# EAGLE design JP Eagle Daughter Board (EAGLE 9.6.2)
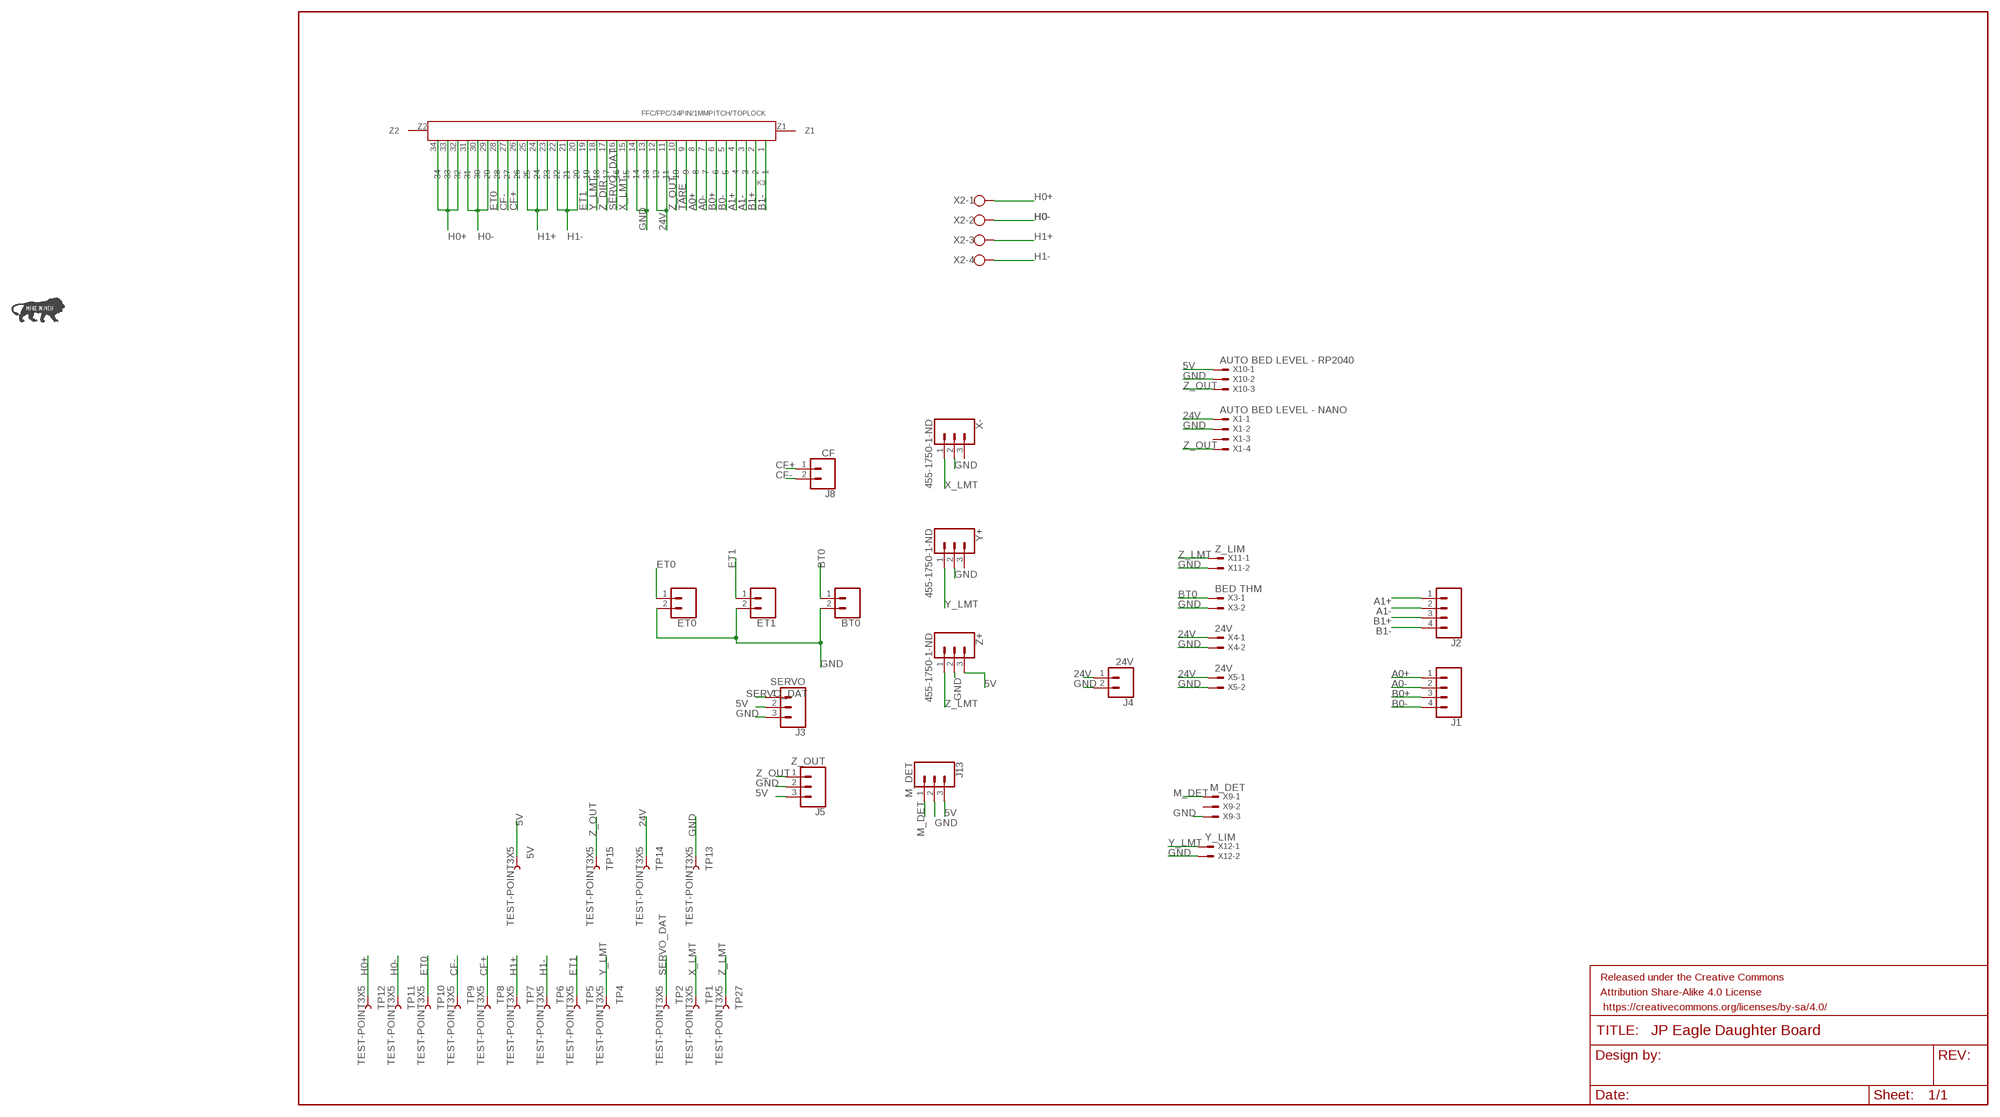
[diagram p0: schematic, sheet 1]

## Parts
5V  TEST-POINT3X5  [PAD.03X.05]
BT0  CONN_02  [1X02]
ET0  CONN_02  [1X02]
ET1  CONN_02  [1X02]
FRAME1  FRAME-LEDGER  [CREATIVE_COMMONS]
J1  CONN_04  [1X04]
J2  CONN_04  [1X04]
J3  SERVO  CONN_03  [1X03]
J4  24V  CONN_02  [1X02]
J5  Z_OUT  CONN_03  [1X03]
J8  CF  CONN_02  [1X02]
J13  M_DET  CONN_03  [1X03]
K3  FFC/FPC/34PIN/1MMPITCH/TOPLOCK  [34PIN/1MMPITCH/FFC/FPC]
TP1  TEST-POINT3X5  [PAD.03X.05]
TP2  TEST-POINT3X5  [PAD.03X.05]
TP4  TEST-POINT3X5  [PAD.03X.05]
TP5  TEST-POINT3X5  [PAD.03X.05]
TP6  TEST-POINT3X5  [PAD.03X.05]
TP7  TEST-POINT3X5  [PAD.03X.05]
TP8  TEST-POINT3X5  [PAD.03X.05]
TP9  TEST-POINT3X5  [PAD.03X.05]
TP10  TEST-POINT3X5  [PAD.03X.05]
TP11  TEST-POINT3X5  [PAD.03X.05]
TP12  TEST-POINT3X5  [PAD.03X.05]
TP13  TEST-POINT3X5  [PAD.03X.05]
TP14  TEST-POINT3X5  [PAD.03X.05]
TP15  TEST-POINT3X5  [PAD.03X.05]
TP27  TEST-POINT3X5  [PAD.03X.05]
U$2  MAKEININDIA  [MAKEININDIA]
X1  AUTO BED LEVEL - NANO  JST-XH-04-PIN-LONG-PAD  [JST-XH-04-PACKAGE-LONG-PAD]
X2  W237-4  [W237-4]
X3  BED THM  JST-XH-02-PIN-LONG-PAD  [JST-XH-02-PACKAGE-LONG-PAD]
X4  24V  JST-XH-02-PIN-LONG-PAD  [JST-XH-02-PACKAGE-LONG-PAD]
X5  24V  JST-XH-02-PIN-LONG-PAD  [JST-XH-02-PACKAGE-LONG-PAD]
X9  M_DET  JST-XH-03-PIN-LONG-PAD  [JST-XH-03-PACKAGE-LONG-PAD]
X10  AUTO BED LEVEL - RP2040  JST-XH-03-PIN-LONG-PAD  [JST-XH-03-PACKAGE-LONG-PAD]
X11  Z_LIM  JST-XH-02-PIN-LONG-PAD  [JST-XH-02-PACKAGE-LONG-PAD]
X12  Y_LIM  JST-XH-02-PIN-LONG-PAD  [JST-XH-02-PACKAGE-LONG-PAD]
X-  455-1750-1-ND  CONN_03  [1X03]
Y+  455-1750-1-ND  CONN_03  [1X03]
Z+  455-1750-1-ND  CONN_03  [1X03]

## Nets
5V: 5V.P$1 J3.2 J5.3 J13.3 X10.1 Z+.3
24V: J4.1 K3.11 K3.12 TP14.P$1 X1.1 X4.1 X5.1
A0+: J1.1 K3.8
A0-: J1.2 K3.7
A1+: J2.1 K3.4
A1-: J2.2 K3.3
B0+: J1.3 K3.6
B0-: J1.4 K3.5
B1+: J2.3 K3.2
B1-: J2.4 K3.1
BT0: BT0.1 X3.1
CF+: J8.1 K3.26 TP8.P$1
CF-: J8.2 K3.27 TP9.P$1
ET0: ET0.1 K3.28 TP10.P$1
ET1: ET1.1 K3.19 TP5.P$1
GND: BT0.2 ET0.2 ET1.2 J3.3 J4.2 J5.2 J13.2 K3.13 K3.14 TP13.P$1 X1.2 X3.2 X4.2 X5.2 X9.3 X10.2 X11.2 X12.2 X-.2 Y+.2 Z+.2
H0+: K3.32 K3.33 K3.34 TP12.P$1 X2.1
H0-: K3.29 K3.30 K3.31 TP11.P$1 X2.2
H1+: K3.23 K3.24 K3.25 TP7.P$1 X2.3
H1-: K3.20 K3.21 K3.22 TP6.P$1 X2.4
M_DET: J13.1 X9.1
SERVO_DAT: J3.1 K3.16 TP2.P$1
TARE: K3.9
X_LMT: K3.15 TP1.P$1 X-.1
Y_LMT: K3.18 TP4.P$1 X12.1 Y+.1
Z_DIR: K3.17
Z_LMT: TP27.P$1 X11.1 Z+.1
Z_OUT: J5.1 K3.10 TP15.P$1 X1.4 X10.3
Unconnected: K3.Z1 K3.Z2 X1.3 X9.2 X-.3 Y+.3

## Library data of the parts
5V TP1 TP2 TP4-TP15 TP27 = SparkFun-Connectors:TEST-POINT: SparkFun Test Points Bare copper test points for troubleshooting or In-Circuit-Testing. These are used by our Production team for verifying production board runs using pogo-pins on test beds. SparkFun Products: SparkFun LSM9DS1 Breakout <https://www.sparkfun.com/products/13284> SparkFun PSOC <https://www.sparkfun.com/products/13714> SparkFun Load Cell Amplifier <https://www.sparkfun.com/products/13879>
BT0 ET0 ET1 J4 J8 = SparkFun-Connectors:CONN_02: Multi connection point. Often used as Generic Header-pin footprint for 0.1 inch spaced/style header connections On any of the 0.1 inch spaced packages, you can populate with these: Break Away Headers - Straight <https://www.sparkfun.com/products/116> (PRT-00116) Break Away Male Headers - Right Angle <https://www.sparkfun.com/products/553> (PRT-00553) Female Headers <https://www.sparkfun.com/products/115> (PRT-00115) Break Away Headers - Machine Pin <https://www.sparkfun.com/products/117> (PRT-00117) Break Away Female Headers - Swiss Machine Pin <https://www.sparkfun.com/products/743> (PRT-00743) For SCREWTERMINALS and SPRING TERMINALS visit here: Screw Terimnals on SparkFun.com <https://www.sparkfun.com/search/results?term=Screw+Terminals> (5mm/3.5mm/2.54mm spacing) This device is also useful as a general connection point to wire up your design to another part of your project. Our various solder wires solder well into these plated through hole pads. Hook-Up Wire - Assortment (Stranded, 22 AWG) <https://www.sparkfun.com/products/11375> (PRT-11375) Hook-Up Wire - Assortment (Solid Core, 22 AWG) <https://www.sparkfun.com/products/11367> (PRT-11367) View the entire wire category on our website here <https://www.sparkfun.com/categories/141> Special notes: Molex polarized connector foot print use with: PRT-08233 with associated crimp pins and housings. 2.54_SCREWTERM for use with PRT-10571. 3.5mm Screw Terminal footprints for PRT-08084 5mm Screw Terminal footprints for use with PRT-08432
FRAME1 = SparkFun-Aesthetics:FRAME-LEDGER: Schematic Frame - Ledger Standard 11x14 US Ledger frame
J1 J2 = SparkFun-Connectors:CONN_04: Multi connection point. Often used as Generic Header-pin footprint for 0.1 inch spaced/style header connections On any of the 0.1 inch spaced packages, you can populate with these: Break Away Headers - Straight <https://www.sparkfun.com/products/116> (PRT-00116) Break Away Male Headers - Right Angle <https://www.sparkfun.com/products/553> (PRT-00553) Female Headers <https://www.sparkfun.com/products/115> (PRT-00115) Break Away Headers - Machine Pin <https://www.sparkfun.com/products/117> (PRT-00117) Break Away Female Headers - Swiss Machine Pin <https://www.sparkfun.com/products/743> (PRT-00743) For SCREWTERMINALS and SPRING TERMINALS visit here: Screw Terimnals on SparkFun.com <https://www.sparkfun.com/search/results?term=Screw+Terminals> (5mm/3.5mm/2.54mm spacing) This device is also useful as a general connection point to wire up your design to another part of your project. Our various solder wires solder well into these plated through hole pads. Hook-Up Wire - Assortment (Stranded, 22 AWG) <https://www.sparkfun.com/products/11375> (PRT-11375) Hook-Up Wire - Assortment (Solid Core, 22 AWG) <https://www.sparkfun.com/products/11367> (PRT-11367) View the entire wire category on our website here <https://www.sparkfun.com/categories/141> Special notes: Molex polarized connector foot print use with SKU : PRT-08231 with associated crimp pins and housings. 1MM SMD Version SKU: PRT-10208; PROD_ID: CONN-09696
J3 J5 J13 = SparkFun-Connectors:CONN_03: Multi connection point. Often used as Generic Header-pin footprint for 0.1 inch spaced/style header connections On any of the 0.1 inch spaced packages, you can populate with these: Break Away Headers - Straight <https://www.sparkfun.com/products/116> (PRT-00116) Break Away Male Headers - Right Angle <https://www.sparkfun.com/products/553> (PRT-00553) Female Headers <https://www.sparkfun.com/products/115> (PRT-00115) Break Away Headers - Machine Pin <https://www.sparkfun.com/products/117> (PRT-00117) Break Away Female Headers - Swiss Machine Pin <https://www.sparkfun.com/products/743> (PRT-00743) Stackable Header - 3 Pin (Female, 0.1") <https://www.sparkfun.com/products/13875> (PRT-13875) For SCREWTERMINALS and SPRING TERMINALS visit here: Screw Terimnals on SparkFun.com <https://www.sparkfun.com/search/results?term=Screw+Terminals> (5mm/3.5mm/2.54mm spacing) This device is also useful as a general connection point to wire up your design to another part of your project. Our various solder wires solder well into these plated through hole pads. Hook-Up Wire - Assortment (Stranded, 22 AWG) <https://www.sparkfun.com/products/11375> (PRT-11375) Hook-Up Wire - Assortment (Solid Core, 22 AWG) <https://www.sparkfun.com/products/11367> (PRT-11367) View the entire wire category on our website here <https://www.sparkfun.com/categories/141> Special notes: Molex polarized connector foot print use with SKU : PRT-08232 with associated crimp pins and housings.; PROD_ID: XXX-00000; VALUE: 455-1750-1-ND
K3 = FracktalWorks_Eagle_Library:FFC/FPC/34PIN/1MMPITCH/TOPLOCK
U$2 = FracktalWorks_Eagle_Library:MAKEININDIA
X1 = Rembrandt Electronics - JST XH Connectors v1-0:JST-XH-04-PIN: JST XH Connector 2 Pin Wire to board connector. Pitch: 2,54 mm, (0.100") Number of pins: 4 Created by Rembrandt Electronics www.rembrandtelectronics.com
X2 = con-wago-500:W237-4: WAGO SCREW CLAMP; OC_FARNELL: unknown; OC_NEWARK: unknown
X3-X5 X11 X12 = Rembrandt Electronics - JST XH Connectors v1-0:JST-XH-02-PIN: JST XH Connector 2 Pin Wire to board connector. Pitch: 2,54 mm, (0.100") Number of pins: 2 Created by Rembrandt Electronics www.rembrandtelectronics.com
X9 X10 = Rembrandt Electronics - JST XH Connectors v1-0:JST-XH-03-PIN: JST XH Connector 2 Pin Wire to board connector. Pitch: 2,54 mm, (0.100") Number of pins: 3 Created by Rembrandt Electronics www.rembrandtelectronics.com
X- Y+ Z+ = SparkFun-Connectors:CONN_03: Multi connection point. Often used as Generic Header-pin footprint for 0.1 inch spaced/style header connections On any of the 0.1 inch spaced packages, you can populate with these: Break Away Headers - Straight <https://www.sparkfun.com/products/116> (PRT-00116) Break Away Male Headers - Right Angle <https://www.sparkfun.com/products/553> (PRT-00553) Female Headers <https://www.sparkfun.com/products/115> (PRT-00115) Break Away Headers - Machine Pin <https://www.sparkfun.com/products/117> (PRT-00117) Break Away Female Headers - Swiss Machine Pin <https://www.sparkfun.com/products/743> (PRT-00743) Stackable Header - 3 Pin (Female, 0.1") <https://www.sparkfun.com/products/13875> (PRT-13875) For SCREWTERMINALS and SPRING TERMINALS visit here: Screw Terimnals on SparkFun.com <https://www.sparkfun.com/search/results?term=Screw+Terminals> (5mm/3.5mm/2.54mm spacing) This device is also useful as a general connection point to wire up your design to another part of your project. Our various solder wires solder well into these plated through hole pads. Hook-Up Wire - Assortment (Stranded, 22 AWG) <https://www.sparkfun.com/products/11375> (PRT-11375) Hook-Up Wire - Assortment (Solid Core, 22 AWG) <https://www.sparkfun.com/products/11367> (PRT-11367) View the entire wire category on our website here <https://www.sparkfun.com/categories/141> Special notes: Molex polarized connector foot print use with SKU : PRT-08232 with associated crimp pins and housings.; PROD_ID: XXX-00000

## Board
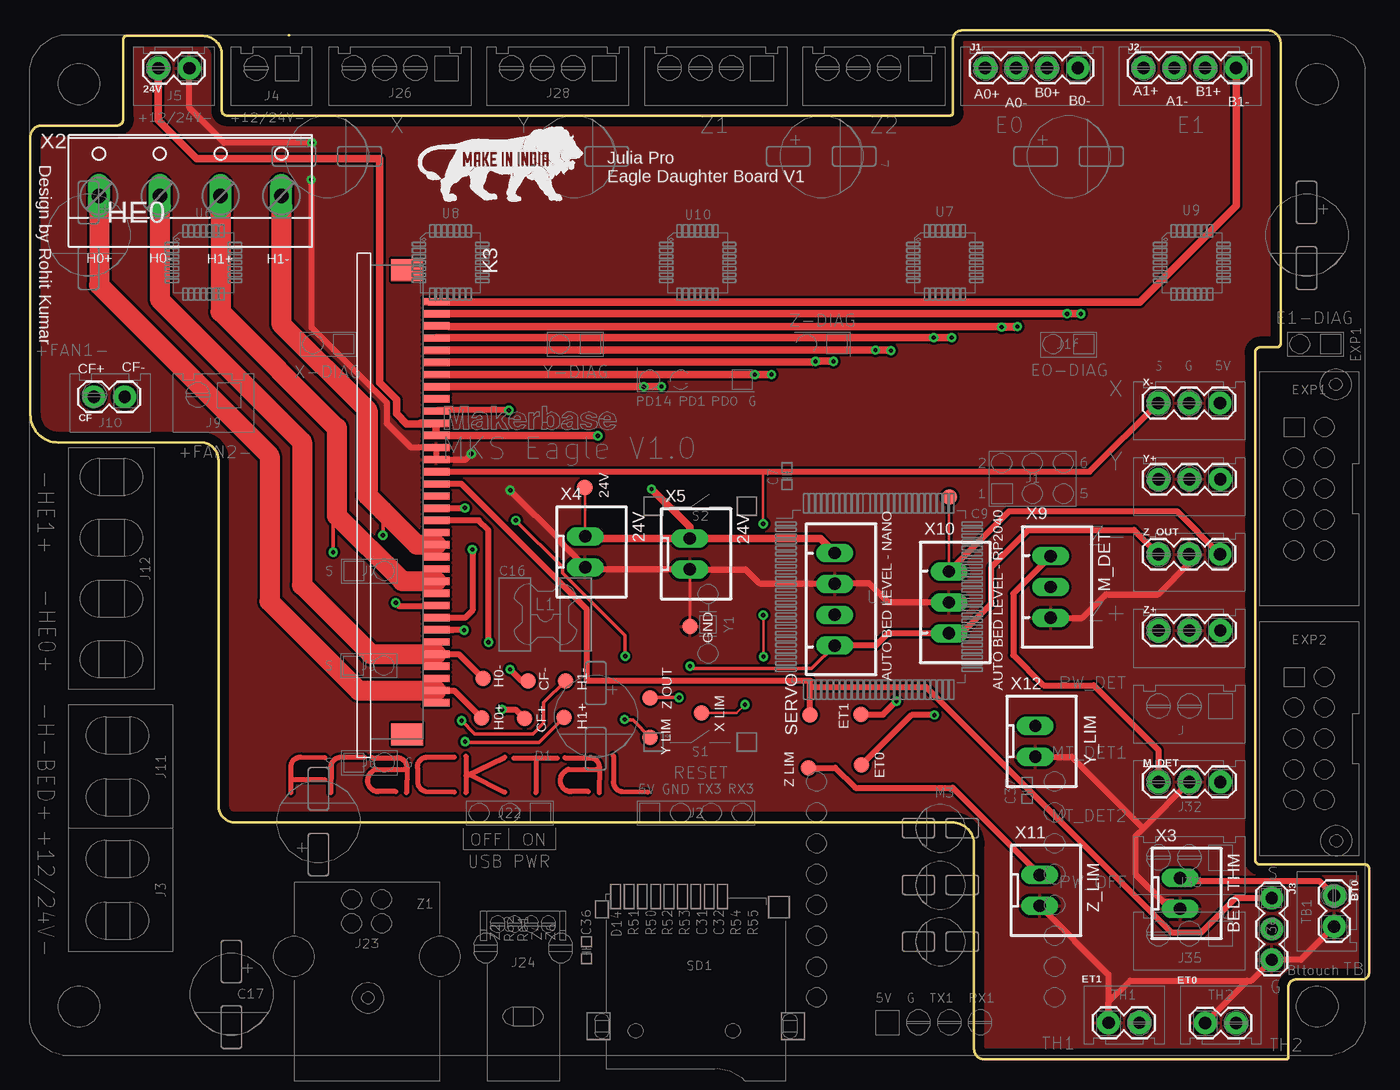
[diagram p1: board, top side]
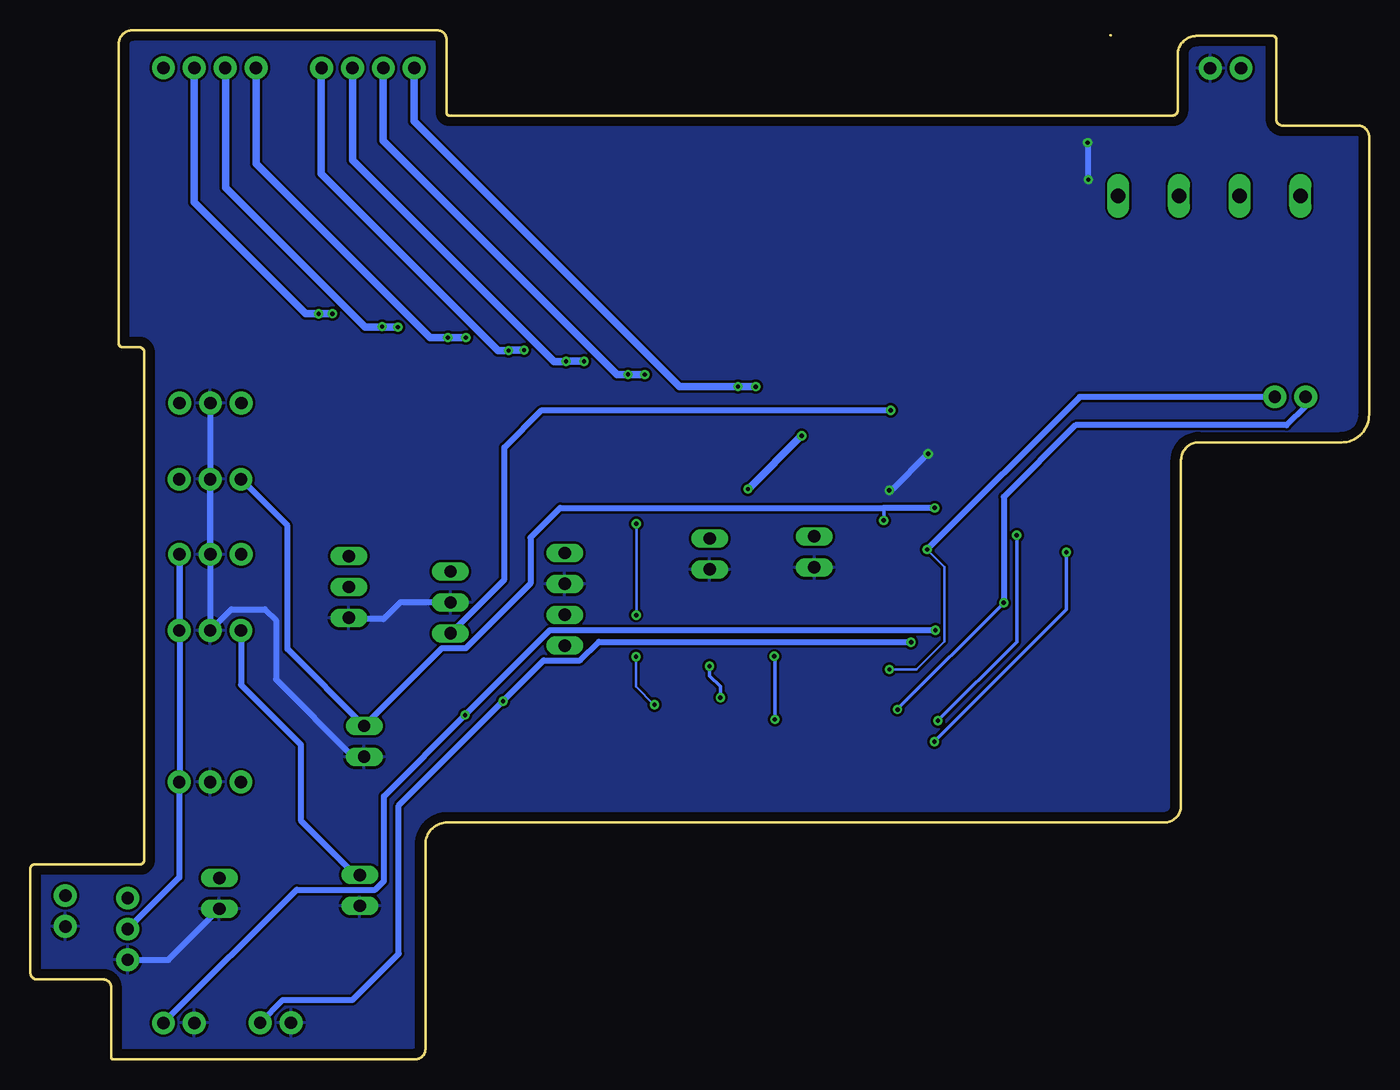
[diagram p2: board, bottom side, seen from below]

Size 110.16 x 84.67 mm. Coordinates in mm from the lower left corner, seen from the top.
Outline: 21.27,84.28 arc-90 21.28,84.28
Outline: 16.84,19.48 arc-90 15.48,20.87 15.48,49.31 arc90 14.02,50.77 2.28,50.77 arc-90 0,53.04 0,75.92 arc-90 0.91,76.83 7.1,76.83 arc90 7.65,77.38 7.65,83.94 arc-90 7.92,84.21 14.2,84.21 arc-90 15.75,82.67 15.75,78.11 arc90 16.21,77.65 75.65,77.65 arc90 75.93,77.93 75.93,83.94 arc-90 76.66,84.67 101.78,84.67 arc-90 102.88,83.58 102.88,58.88 arc-90 102.6,58.6 101.24,58.6 arc90 100.78,58.15 100.78,16.41 arc90 101.15,16.04 109.79,16.04 arc-90 110.16,15.68 110.16,7.11 arc-90 109.61,6.56 104.15,6.56 arc90 103.51,5.92 103.51,0.18 arc-90 103.33,0 78.48,0 arc-90 77.66,0.82 77.66,17.68 arc90 75.84,19.48 16.84,19.48
Copper layers (1*16): Top 0.035mm / dielectric 1.5mm / Bottom 0.035mm
Design rules "LionCircuits": minimum track width 8mil, minimum drill 0.35mm, track to track 8mil, track to pad 8mil, pad to pad 8mil, via to via 8mil, smd to smd 8mil, copper to edge 30mil, drill to drill 10mil, minimum pad ring 10mil, minimum via ring 8mil, stop-mask expansion 4mil, vias tented up to drill 0mil, thermal gap 10mil

### Footprints (pad centres in the part's own frame; a part is rotated, then mirrored left to right if it is on the bottom)
PAD.03X.05 = smd 1.27 x 1.27: P$1 0,0
1X02 = drill 1.016 pad 1.88: 1 0,0; 2 2.54,0
1X04 = drill 1.016 pad 1.88: 1 0,0; 2 2.54,0; 3 5.08,0; 4 7.62,0
1X03 = drill 1.016 pad 1.88: 1 0,0; 2 2.54,0; 3 5.08,0
34PIN/1MMPITCH/FFC/FPC = smd 0.6 x 2.2: 1 -14.43,2.1; 2 -13.43,2.1; 3 -12.43,2.1; 4 -11.43,2.1; 5 -10.43,2.1; 6 -9.43,2.1; 7 -8.43,2.1; 8 -7.43,2.1; 9 -6.43,2.1; 10 -5.43,2.1; 11 -4.43,2.1; 12 -3.43,2.1; 13 -2.43,2.1; 14 -1.43,2.1; 15 -0.43,2.1; 16 0.57,2.1; 17 1.57,2.1; 18 2.57,2.1; 19 3.57,2.1; 20 4.57,2.1; 21 5.57,2.1; 22 6.57,2.1; 23 7.57,2.1; 24 8.57,2.1; 25 9.57,2.1; 26 10.57,2.1; 27 11.57,2.1; 28 12.57,2.1; 29 13.57,2.1; 30 14.57,2.1; 31 15.57,2.1; 32 16.57,2.1; 33 17.57,2.1; 34 18.57,2.1 | smd 1.8 x 2.6: Z1 -17.03,-0.3; Z2 21.17,-0.3
JST-XH-04-PACKAGE-LONG-PAD = drill 1.016 long: 1 -3.81,0; 2 -1.27,0; 3 1.27,0; 4 3.81,0
W237-4 = drill 1.194 long: 1 -7.5,-1.27; 2 -2.5,-1.27; 3 2.5,-1.27; 4 7.5,-1.27
JST-XH-02-PACKAGE-LONG-PAD = drill 1.016 long: 1 -1.27,0; 2 1.27,0
JST-XH-03-PACKAGE-LONG-PAD = drill 1.016 long: 1 -2.54,0; 2 0,0; 3 2.54,0

### Placement (x,y rotation side)
5V  75.62,46.25 0 top
BT0  107.28,13.46 270 top
ET0  99.21,2.98 180 top
ET1  91.26,3 180 top
FRAME1  -90.02,10.67 0 top  (outside the outline)
J1  78.58,81.58 0 top
J2  91.59,81.59 0 top
J3  102.16,13.26 270 top
J4  10.53,81.56 0 top
J5  92.81,41.55 0 top
J8  5.23,54.51 0 top
J13  92.83,22.81 0 top
K3  31.3,47.92 270 top
TP1  55.22,28.5 0 top
TP2  64.15,28.32 0 top
TP4  50.99,26.51 180 top
TP5  68.36,28.37 0 top
TP6  44.05,31.15 0 top
TP7  43.93,28.14 0 top
TP8  40.65,28.04 0 top
TP9  40.93,31.14 0 top
TP10  68.39,24.22 0 top
TP11  37.25,31.32 0 top
TP12  37.12,28.08 0 top
TP13  54.29,35.61 0 top
TP14  45.62,47.05 0 top
TP15  51,29.74 0 top
TP27  64.02,23.99 0 top
U$1  FRACKTALLOGO  [FRACKTALLOGO]  33.42,21.85 0 top
U$2  32.87,69.88 0 top
X1  66.19,37.85 270 top
X2  13.15,72.31 0 top
X3  94.62,13.65 270 top
X4  45.66,41.76 270 top
X5  54.26,41.58 270 top
X9  83.97,38.86 270 top
X10  75.58,37.59 270 top
X11  83.05,13.9 270 top
X12  82.7,26.16 270 top
X-  92.8,54 0 top
Y+  92.83,47.73 0 top
Z+  92.83,35.28 0 top

### Tracks (layer width: path | path; a pad name or v marks a point on that pad's centre or on a via)
5V
  Top 0.203: X10.1 75.58,46.21 5V.P$1
  Top 0.508: X10.1 80.56,45.11 94.34,45.11 J5.3
  Bottom 0.508: J3.2 97.91,14.96 J13.3 97.89,22.83 J5.3 97.89,35.3 Z+.3
24V  (via drill 0.35)
  Top 0.203: X4.1 45.66,47.01 TP14.P$1
  Top 0.508: K3.11 | 45.83,42.85 X4.1 | 46.66,51.34 v46.7,51.31
  Top 0.61: K3.11 32.1,52.34 | J4.1 10.53,77.28 13.68,74.13 28.73,74.13 28.73,55.69 30.11,54.3 30.11,53.12 30.97,52.26 33.32,52.26 K3.11 K3.12 46.66,51.34 | X5.1 64.99,42.85 X1.1 | X5.1 45.83,42.85 | v51.1,46.94 54.26,43.78 X5.1
  Bottom 0.508: 51.07,46.94 v51.1,46.94
  Bottom 0.61: v46.7,51.31 51.07,46.94
A0+  (via drill 0.35)
  Top 0.508: 51.92,55.34 v51.93,55.36 | v51.93,55.36 | v51.93,55.36
  Top 0.61: K3.8 v50.48,55.34 51.92,55.34
  Bottom 0.508: v51.93,55.36 v51.92,55.36 | 50.48,55.36 v50.48,55.34
  Bottom 0.61: v51.93,55.36 56.73,55.36 78.58,77.21 J1.1 | v51.92,55.36 50.48,55.36
A0-  (via drill 0.35)
  Top 0.508: v59.61,56.36 v59.6,56.35 | K3.7
  Top 0.61: v60.99,56.36 v59.61,56.36 | v59.6,56.35 K3.7
  Bottom 0.508: v60.99,56.36 61,56.36 60.99,56.35
  Bottom 0.61: J1.2 81.12,75.58 61.89,56.36 61,56.36 | v59.6,56.35 60.99,56.35
A1+  (via drill 0.35)
  Top 0.508: 33.44,59.38 K3.4
  Top 0.61: v75.8,59.38 v74.33,59.38 33.44,59.38
  Bottom 0.508: v75.81,59.38 v75.82,59.38
  Bottom 0.61: J2.1 91.59,73.69 77.28,59.38 v75.8,59.38 | v74.33,59.38 v75.81,59.38
A1-  (via drill 0.35)
  Top 0.508: v79.92,60.26 79.93,60.25 | 33.87,60.29 34.46,60.29 | v81.21,60.29 81.18,60.26 | 33.66,60.34 K3.3
  Top 0.61: v81.21,60.29 34.46,60.29 34.41,60.34 33.66,60.34 | 81.18,60.26 v79.92,60.26
  Bottom 0.508: 94.09,81.59 J2.2 | v81.21,60.29 81.25,60.25 | 79.92,60.24 v79.92,60.26
  Bottom 0.61: 94.09,81.59 94.09,71.73 82.62,60.26 v79.92,60.26
B0+  (via drill 0.35)
  Top 0.508: v64.59,57.44 64.53,57.37 | K3.6 33.42,57.37
  Top 0.61: v66.08,57.44 v64.59,57.44 | 64.53,57.37 33.42,57.37
  Bottom 0.508: 66.09,57.42 v66.08,57.44 | v66.08,57.44
  Bottom 0.61: J1.3 83.66,74 67.08,57.42 66.09,57.42 | v64.59,57.44 66.11,57.44
B0-  (via drill 0.35)
  Top 0.508: v70.82,58.32 70.79,58.35 | 33.41,58.35 K3.5
  Top 0.61: 70.79,58.35 v69.54,58.35 33.41,58.35
  Bottom 0.508: 86.23,81.58 J1.4 | 70.82,58.31 v70.82,58.32
  Bottom 0.61: 86.23,81.58 86.23,72.86 71.67,58.31 70.82,58.31 | v69.54,58.35 70.85,58.35
B1+  (via drill 0.35)
  Top 0.508: v86.44,61.35 v86.44,61.34 | v85.31,61.35 v85.31,61.34 | K3.2
  Top 0.61: v86.44,61.35 K3.2
  Bottom 0.508: 96.69,81.59 J2.3 | v86.44,61.35 v86.45,61.34 | v85.31,61.35
  Bottom 0.61: J2.3 96.67,70.52 87.49,61.34 v86.45,61.34 | v86.44,61.35 v85.31,61.35
B1-
  Top 0.508: K3.1 33.43,62.37 | 32.82,62.32 32.77,62.37
  Top 0.61: J2.4 99.21,70.24 91.29,62.32 33.4,62.32 K3.1 33.38,62.32 32.82,62.32
  Bottom 0.508: 99.09,81.59 J2.4
BT0
  Top 0.508: BT0.1 106.09,14.66 101.58,14.66 101.54,14.62 94.91,14.62 X3.1
CF+  (via drill 0.35)
  Top 0.508: v30.07,37.56 30.34,37.29 32.15,37.29 32.67,37.29 33.34,37.29 K3.26 | v38.8,28.78 39.91,28.78 TP8.P$1
  Bottom 0.305: v30.07,37.56 38.8,28.83 v38.8,28.78
  Bottom 0.508: J8.1 5.23,53.75 6.8,52.17 24.16,52.17 30.07,46.27 v30.07,37.56 30.07,37.51
CF-  (via drill 0.35)
  Top 0.508: v36.37,41.96 36.37,36.94 35.75,36.32 33.42,36.32 K3.27 | v39.48,32.08 40.41,31.14 TP9.P$1
  Bottom 0.203: v36.37,41.96 34.93,40.52 34.93,34.38 37.24,32.07 39.48,32.07
  Bottom 0.508: J8.2 23.82,54.51 v36.37,41.96 | 39.48,32.07 v39.48,32.08
ET0  (via drill 0.35)
  Top 0.508: v74.38,28.33 72.5,28.33 TP10.P$1 | v35.69,35.31 34.77,35.31 | 34.77,35.31 34.11,35.31 34.05,35.37 | K3.28 34.73,35.34 34.77,35.31
  Bottom 0.508: ET0.1 88.24,13.95 81.79,13.95 81.07,14.66 81.07,21.64 v74.38,28.33 67.4,35.31 v35.69,35.31
ET1  (via drill 0.35)
  Top 0.508: v37.69,34.32 37.69,43.55 36.89,44.34 K3.19 | TP5.P$1 70.16,28.37 v71.27,29.47 71.28,29.48
  Bottom 0.508: ET1.1 89.38,4.87 83.66,4.87 79.85,8.68 79.85,20.89 v71.27,29.47 67.92,32.82 64.92,32.82 63.38,34.36 37.73,34.36 v37.69,34.32
GND  (via drill 0.35)
  Top 0.203: X5.2 54.26,35.64 TP13.P$1
  Top 0.508: v23.1,72.39 23.14,72.39 23.14,60.2 29.35,53.99 29.35,52.31 31.32,50.34 K3.13 K3.14 35.8,49.34 v36.29,49.83 | v23.16,75.42 15.95,75.42 13.07,78.3 J4.2 | X10.2 70.59,37.59 69.03,39.16 66.22,39.16 | X9.3 86.56,36.32 88.5,38.26 92.8,38.26 95.35,40.82 J5.2 | X1.2 66.22,39.16 | 100.11,6.47 90.5,6.47 88.72,4.69 ET1.2 88.72,6.97 X11.2 | 100.11,6.47 100.45,6.47 J3.3 104.54,8.18 BT0.2 | ET0.2 100.11,6.42 100.11,6.47 | J13.2 91.58,19.02 | 91.58,19.02 90.93,18.37 90.93,15.23 93.21,12.95 94.05,12.95 X3.2 | 66.22,39.16 59.98,39.16 58.82,40.31 X5.2 45.83,40.31 X4.2 45.66,40.54 43.67,42.52 43.67,42.63 v39.48,46.82 | X12.2 85.7,24.89 91.58,19.02
  Bottom 0.508: v23.1,72.39 23.15,72.44 v23.15,75.41 v23.16,75.42 | v23.16,75.42 | X-.2 95.34,47.9 | 95.34,47.9 95.34,41.5 | 95.34,41.5 95.34,35.31 Z+.2 93.63,37.02 90.87,37.02 89.95,36.11 89.95,31.26 83.58,24.89 X12.2 | Y+.2 95.37,41.52 95.34,41.5 | X10.2 79.73,37.59 81.1,36.22 83.86,36.22 X9.3 | v36.29,49.83 39.29,46.82 v39.48,46.82 | J3.3 98.82,8.18 X3.2 | J5.2 95.35,47.89 95.34,47.9
  pour Top: -2.74,86.01 112.59,86.01 112.59,-2.04 -2.72,-2.04 -2.72,85.99
  pour Bottom: -2.74,86 112.6,86 112.6,-2.04 -2.74,-2.04 -2.74,85.99
H0+
  Top 0.508: K3.33 34.86,30.34 TP12.P$1 | K3.33 K3.34 | K3.32 K3.33
  Top 1.651: X2.1 5.65,63.72 19.69,49.68 19.69,37.68 27.02,30.34 K3.33
H0-
  Top 0.508: TP11.P$1 35.23,33.34 K3.30 K3.29 K3.31
  Top 1.651: X2.2 10.65,62.52 22.35,50.81 22.35,39.01 28.02,33.34 K3.30
H1+  (via drill 0.35)
  Top 0.305: 25.22,44.75 24.91,44.44 v24.91,41.73 | v35.77,26.13 35.82,26.08 41.87,26.08 TP7.P$1
  Top 0.508: K3.25 K3.23 K3.24
  Top 1.651: X2.3 15.65,61.51 25.22,51.94 25.22,44.75 30.62,39.34 K3.24
  Bottom 0.305: v24.91,41.73 24.91,37.03 35.77,26.17 v35.77,26.13
H1-  (via drill 0.35)
  Top 0.305: 29.02,45.12 29.02,43.11 29.01,43.11 v29,43.12 | v29,43.12 | TP6.P$1 42.25,29.35 42.25,27.68 41.35,26.78 36.56,26.78 v35.48,27.86 | v35.48,27.86
  Top 0.508: K3.20 K3.22 K3.21
  Top 1.651: X2.4 20.65,60.51 27.75,53.41 27.75,46.45 27.72,46.42 29.02,45.12 31.79,42.34 K3.21
  Bottom 0.305: v29,43.12 29,34.34 v35.48,27.86
M_DET
  Top 0.508: X9.1 80.87,38.31 80.87,33.27 83.36,30.78 87.49,30.78 92.83,25.44 J13.1
SERVO_DAT
  Top 0.508: K3.16 35.47,47.34 45.8,37.01 45.8,31.15 64.15,31.15 64.15,30.65 | J3.1 99.16,13.26 96.31,10.41 93.93,10.41 73.69,30.65 64.15,30.65 | TP2.P$1 64.15,30.65
X_LMT  (via drill 0.35)
  Top 0.203: 60.29,48.34 v60.29,44.08 v60.3,44.07 | v60.31,36.55 v60.31,33.14 v60.31,33.13 | v58.8,29.18 58.12,28.5 TP1.P$1
  Top 0.508: K3.15 60.29,48.34 87.15,48.34 X-.1
  Bottom 0.203: v60.3,44.07 v60.3,36.56 v60.31,36.55 | v60.31,33.13 60.31,30.66 58.83,29.18 v58.8,29.18
Y_LMT  (via drill 0.35)
  Top 0.305: TP4.P$1 49.58,27.91 48.94,27.91 v48.9,27.96 | v48.9,27.96 | v39.94,44.35 43.78,40.51 43.78,40.03 48.94,34.86 v48.94,33.16
  Top 0.508: K3.18 33.43,45.38 v35.75,45.38
  Bottom 0.305: v48.9,27.96 48.9,33.12 v48.94,33.16 | v39.94,44.35 39.94,45.38
  Bottom 0.508: Y+.1 89.01,43.91 89.01,33.75 X12.1 76.29,33.84 74.32,33.84 69.01,39.15 69.01,42.93 66.56,45.38 39.94,45.38 v35.75,45.38
Z_LMT
  Top 0.508: TP27.P$1 66.22,23.99 67.88,22.33 75.89,22.33 X11.1 | X11.1 | X11.1 83.07,15.16
  Bottom 0.508: Z+.1 92.83,30.82 87.92,25.91 87.92,19.66 83.42,15.17 X11.1
Z_OUT  (via drill 0.35)
  Top 0.305: X1.4 64.29,32.14 54.49,32.14 v54.29,32.34 | v53.38,29.76 51.01,29.76 TP15.P$1
  Top 0.508: X1.4 69.56,34.04 70.58,35.05 X10.3 76.62,35.05 79.08,37.52 79.08,40.53 82.12,43.56 90.81,43.56 J5.1 | v39.37,53.41 33.46,53.41 K3.10
  Bottom 0.305: v54.29,32.34 54.29,31.56 53.38,30.66 v53.38,29.76
  Bottom 0.508: X10.3 71.15,39.49 71.15,50.35 68.09,53.41 v39.37,53.41

### Text on the board
tNames: A0+ | B0+ | B0- | A1+ | A1- | B1+ | A0- | B1- | Design by Rohit Kumar | Julia Pro / Eagle Daughter Board V1 | HE0 | H0+ | H0- | H1+ | H1- | CF+ | CF- | 24V | GND | SERVO | H0- | CF- | H1- | Z OUT | H0+ | CF+ | H1+ | X LIM | ET1 | Y LIM | Z LIM | ET0